# EAGLE design DVCA_v1_3 (EAGLE 7.3.0)
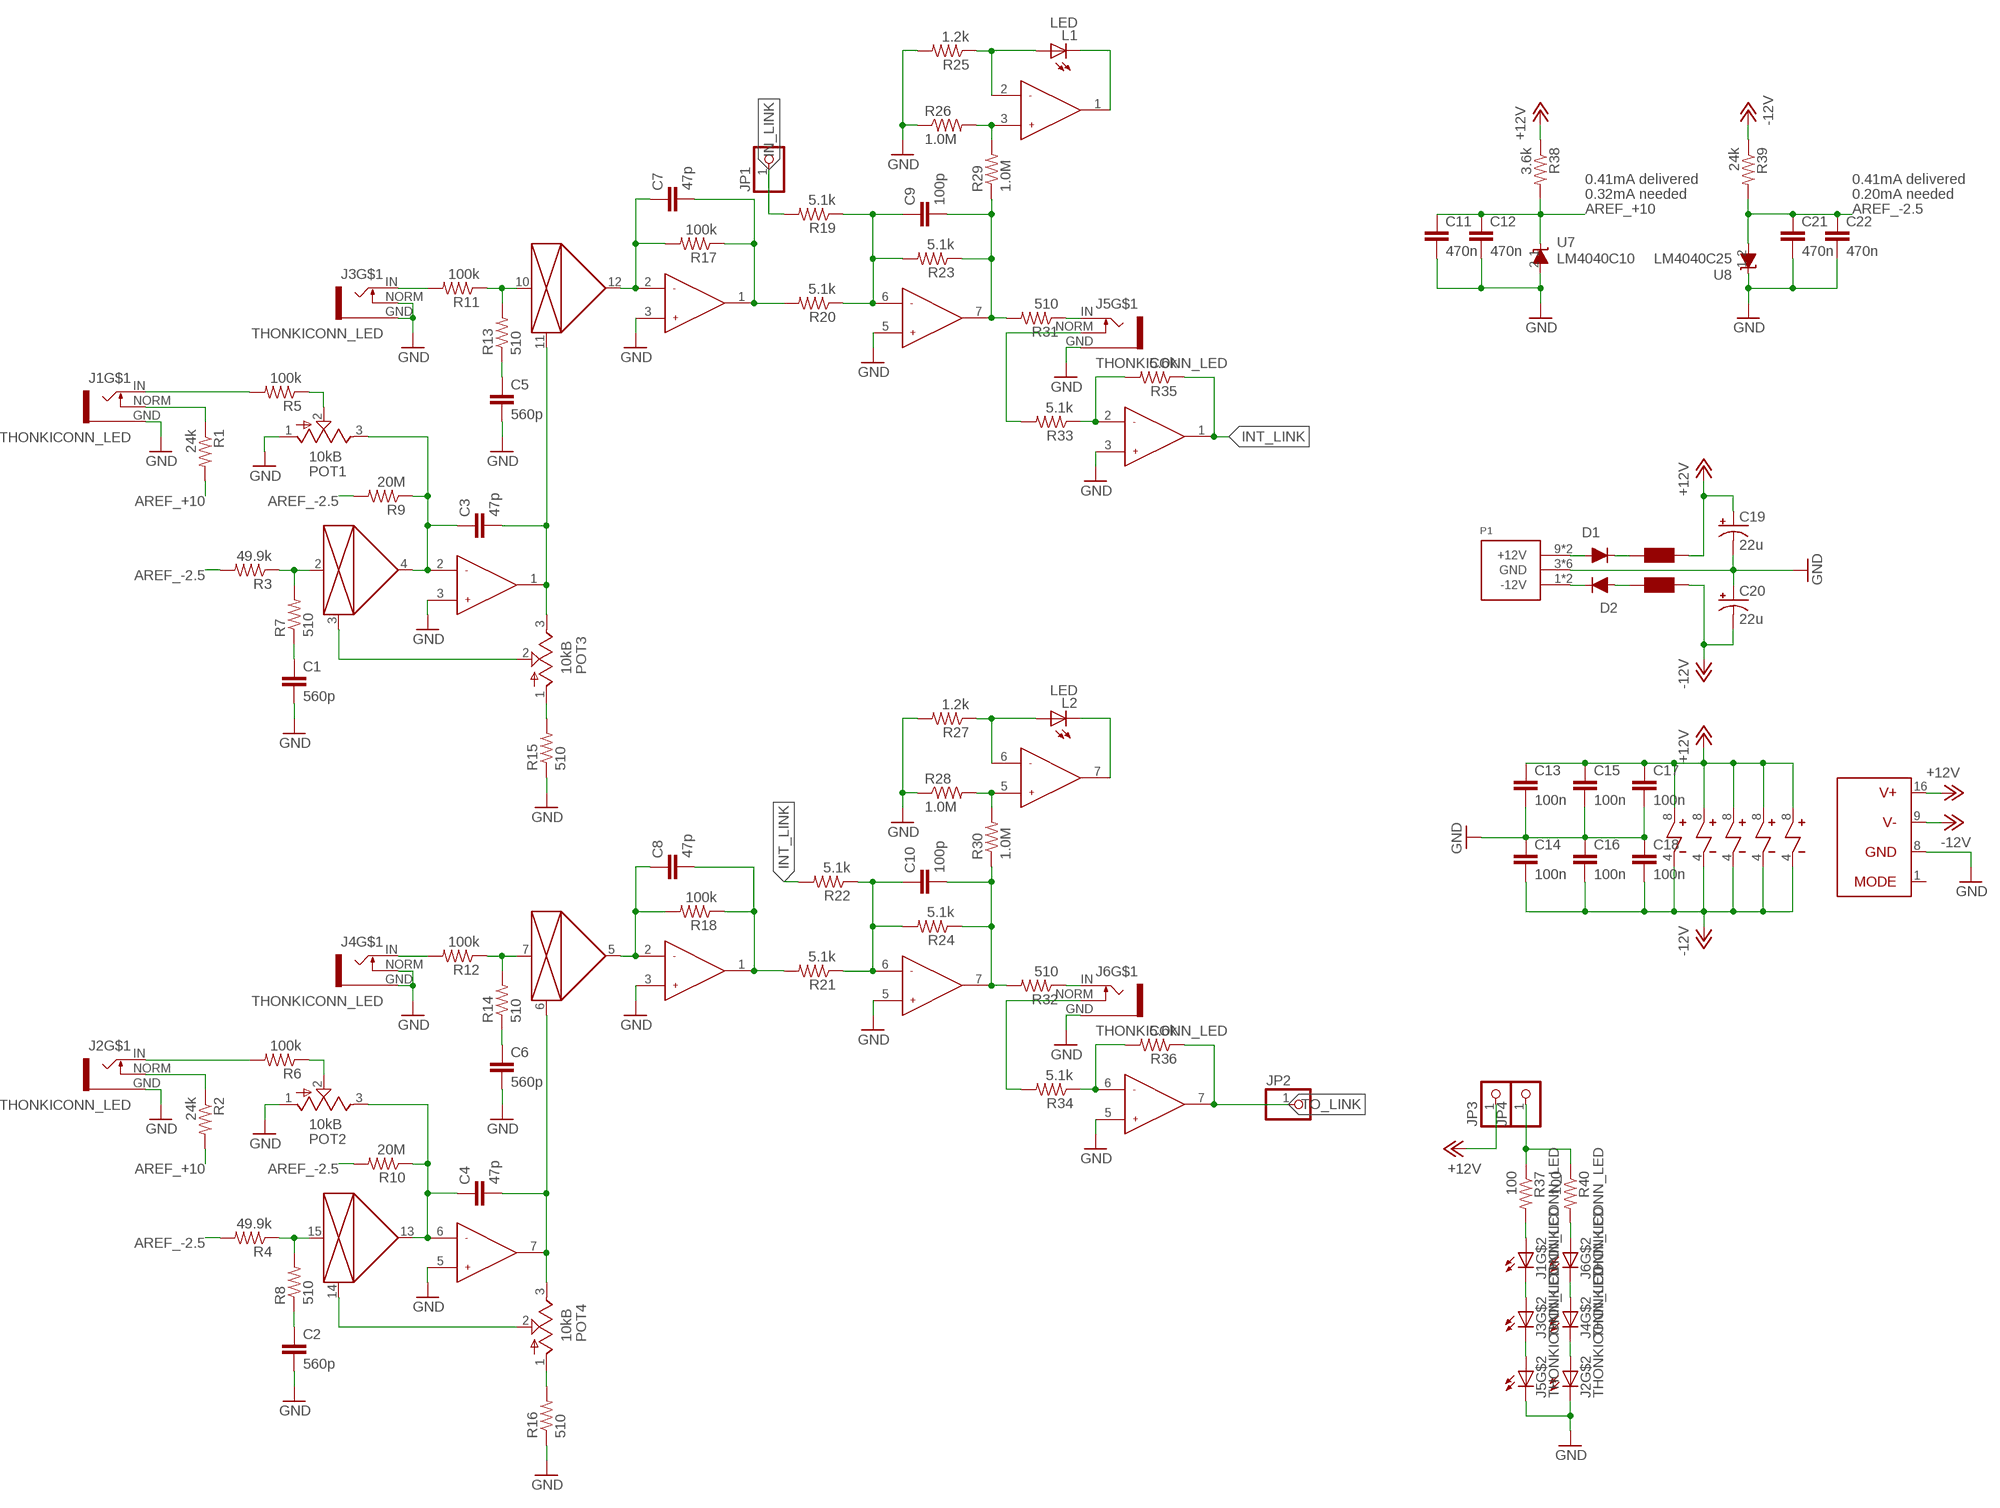
[diagram p0: schematic, sheet 1]

## Parts
C1  560p  CAPACITOR  [RESISTOR_0603]
C2  560p  CAPACITOR  [RESISTOR_0603]
C3  47p  CAPACITOR  [RESISTOR_0603]
C4  47p  CAPACITOR  [RESISTOR_0603]
C5  560p  CAPACITOR  [RESISTOR_0603]
C6  560p  CAPACITOR  [RESISTOR_0603]
C7  47p  CAPACITOR  [RESISTOR_0603]
C8  47p  CAPACITOR  [RESISTOR_0603]
C9  100p  CAPACITOR  [RESISTOR_0603]
C10  100p  CAPACITOR  [RESISTOR_0603]
C11  470n  CAPACITOR  [RESISTOR_0603]
C12  470n  CAPACITOR  [RESISTOR_0603]
C13  100n  CAPACITOR  [RESISTOR_0603]
C14  100n  CAPACITOR  [RESISTOR_0603]
C15  100n  CAPACITOR  [RESISTOR_0603]
C16  100n  CAPACITOR  [RESISTOR_0603]
C17  100n  CAPACITOR  [RESISTOR_0603]
C18  100n  CAPACITOR  [RESISTOR_0603]
C19  22u  CAP_POL  [PANASONIC_B]
C20  22u  CAP_POL  [PANASONIC_B]
C21  470n  CAPACITOR  [RESISTOR_0603]
C22  470n  CAPACITOR  [RESISTOR_0603]
D1  1N5819HW  DIODE  [SOD123]
D2  1N5819HW  DIODE  [SOD123]
F1  FERRITE-BEAD  [RESISTOR_0603]
F2  FERRITE-BEAD  [RESISTOR_0603]
J1  THONKICONN_LED  [LED_JACK]
J2  THONKICONN_LED  [LED_JACK]
J3  THONKICONN_LED  [LED_JACK]
J4  THONKICONN_LED  [LED_JACK]
J5  THONKICONN_LED  [LED_JACK]
J6  THONKICONN_LED  [LED_JACK]
JP1  PINHD-1X1  [1X01]
JP2  PINHD-1X1  [1X01]
JP3  PINHD-1X1  [1X01]
JP4  PINHD-1X1  [1X01]
L1  LED  [LED_3MM]
L2  LED  [LED_3MM]
P1  POWER_SIMPLE10  [POWER_10]
POT1  10kB  POT_VERTICAL  [ALPS_POT_VERTICAL]
POT2  10kB  POT_VERTICAL  [ALPS_POT_VERTICAL]
POT3  10kB  POT_VERTICALNOHOLE  [ALPS_POT_NOHOLE]
POT4  10kB  POT_VERTICALNOHOLE  [ALPS_POT_NOHOLE]
R1  24k  RESISTOR  [RESISTOR_0603]
R2  24k  RESISTOR  [RESISTOR_0603]
R3  49.9k  RESISTOR  [RESISTOR_0603]
R4  49.9k  RESISTOR  [RESISTOR_0603]
R5  100k  RESISTOR  [RESISTOR_0603]
R6  100k  RESISTOR  [RESISTOR_0603]
R7  510  RESISTOR  [RESISTOR_0603]
R8  510  RESISTOR  [RESISTOR_0603]
R9  20M  RESISTOR  [RESISTOR_0603]
R10  20M  RESISTOR  [RESISTOR_0603]
R11  100k  RESISTOR  [RESISTOR_0603]
R12  100k  RESISTOR  [RESISTOR_0603]
R13  510  RESISTOR  [RESISTOR_0603]
R14  510  RESISTOR  [RESISTOR_0603]
R15  510  RESISTOR  [RESISTOR_0603]
R16  510  RESISTOR  [RESISTOR_0603]
R17  100k  RESISTOR  [RESISTOR_0603]
R18  100k  RESISTOR  [RESISTOR_0603]
R19  5.1k  RESISTOR  [RESISTOR_0603]
R20  5.1k  RESISTOR  [RESISTOR_0603]
R21  5.1k  RESISTOR  [RESISTOR_0603]
R22  5.1k  RESISTOR  [RESISTOR_0603]
R23  5.1k  RESISTOR  [RESISTOR_0603]
R24  5.1k  RESISTOR  [RESISTOR_0603]
R25  1.2k  RESISTOR  [RESISTOR_0603]
R26  1.0M  RESISTOR  [RESISTOR_0603]
R27  1.2k  RESISTOR  [RESISTOR_0603]
R28  1.0M  RESISTOR  [RESISTOR_0603]
R29  1.0M  RESISTOR  [RESISTOR_0603]
R30  1.0M  RESISTOR  [RESISTOR_0603]
R31  510  RESISTOR  [RESISTOR_0603]
R32  510  RESISTOR  [RESISTOR_0603]
R33  5.1k  RESISTOR  [RESISTOR_0603]
R34  5.1k  RESISTOR  [RESISTOR_0603]
R35  5.6k  RESISTOR  [RESISTOR_0603]
R36  5.6k  RESISTOR  [RESISTOR_0603]
R37  100  RESISTOR  [RESISTOR_0603]
R38  3.6k  RESISTOR  [RESISTOR_0603]
R39  24k  RESISTOR  [RESISTOR_0603]
R40  100  RESISTOR  [RESISTOR_0603]
U1  V2164M  [SOIC16]
U2  OPAMP_DUAL  [SOIC8]
U3  OPAMP_DUAL  [SOIC8]
U4  OPAMP_DUAL  [SOIC8]
U5  OPAMP_DUAL  [SOIC8]
U6  OPAMP_DUAL  [SOIC8]
U7  LM4040C10  LM4040SOT23  [SOT23]
U8  LM4040C25  LM4040SOT23  [SOT23]

## Nets
+12V: C13.1 C15.1 C17.1 C19.+ F1.1 JP3.1 R38.1 U1.16 U2.8 U3.8 U4.8 U5.8 U6.8
-12V: C14.2 C16.2 C18.2 C20.- F2.1 R39.1 U1.9 U2.4 U3.4 U4.4 U5.4 U6.4
AREF_+10: C11.1 C12.1 R1.2 R2.2 R38.2 U7.1(C)
AREF_-2.5: C21.1 C22.1 R3.2 R4.2 R9.2 R10.2 R39.2 U8.2(A)
CV_IN_1: J1.IN R5.2
FOO: R3.1 R7.2 U1.2
FOO1: R4.1 R8.2 U1.15
GND: C1.2 C2.2 C5.2 C6.2 C11.2 C12.2 C13.2 C14.1 C15.2 C16.1 C17.2 C18.1 C19.- C20.+ C21.2 C22.2 J1.GND J2.C J2.GND J3.GND J3.NORM J4.GND J4.NORM J5.C J5.GND J6.GND P1.3(GND) P1.4(GND) P1.5(GND) P1.6(GND) P1.7(GND) P1.8(GND) POT1.1(A) POT2.1(A) R15.1 R16.1 R25.2 R26.1 R27.2 R28.1 U1.8 U2.3 U2.5 U3.3 U3.5 U4.3 U4.5 U6.3 U6.5 U7.2(A) U8.1(C)
IN_LINK: JP1.1 R19.2
INT_LINK: R22.2 R35.1 U6.1
N$1: R26.2 R29.2 U5.3
N$2: D1.+ P1.9(+12V) P1.10(+12V)
N$3: J4.IN R12.2
N$4: R28.2 R30.2 U5.5
N$5: D2.- P1.1(-12V) P1.2(-12V)
N$6: J6.IN R32.1
N$7: J5.IN R31.1
N$8: D1.- F1.2
N$9: POT3.2(W) U1.3
N$10: C9.1 R19.1 R20.1 R23.2 U3.6
N$11: J2.A J4.C
N$12: JP4.1 R37.1 R40.1
N$13: J4.A J6.C
N$14: POT1.2(W) R5.1
N$15: POT3.1(A) R15.2
N$17: C6.1 R14.1
N$18: L1.K(C) U5.1
N$19: L1.A R25.1 U5.2
N$20: C1.1 R7.1
N$21: J1.NORM R1.1
N$22: R33.1 R35.2 U6.2
N$23: D2.+ F2.2
N$24: R12.1 R14.2 U1.7
N$25: J5.NORM R33.2
N$26: POT4.2(W) U1.14
N$27: C10.1 R21.1 R22.1 R24.2 U4.6
N$28: J6.A R40.2
N$29: J3.C J5.A
N$30: J1.C J3.A
N$31: J1.A R37.2
N$32: POT4.1(A) R16.2
N$33: C4.2 POT4.3(B) U1.6 U2.7
N$34: C4.1 POT2.3(B) R10.1 U1.13 U2.6
N$35: L2.K(C) U5.7
N$36: L2.A R27.1 U5.6
N$37: R34.1 R36.2 U6.6
N$38: J6.NORM R34.2
N$39: C8.2 R18.1 R21.2 U4.1
N$40: POT2.2(W) R6.1
N$41: C2.1 R8.1
N$43: C3.1 POT1.3(B) R9.1 U1.4 U2.2
N$44: J2.IN R6.2
N$47: C5.1 R13.1
N$53: C8.1 R18.2 U1.5 U4.2
N$64: J2.NORM R2.1
N$66: J3.IN R11.2
N$75: R11.1 R13.2 U1.10
N$87: C3.2 POT3.3(B) U1.11 U2.1
N$96: C7.1 R17.2 U1.12 U3.2
N$100: C7.2 R17.1 R20.2 U3.1
OUT1: C9.2 R23.1 R29.1 R31.2 U3.7
OUT2: C10.2 R24.1 R30.1 R32.2 U4.7
TO_LINK: JP2.1 R36.1 U6.7
Unconnected: U1.1

## Notes on the sheet
- 0.41mA delivered | 0.41mA delivered
- 0.32mA needed | 0.20mA needed

## Library data of the parts
C1-C18 C21 C22 = parts_aman:CAPACITOR
C19 C20 = parts_aman:CAP_POL
D1 D2 = parts_aman:DIODE
F1 F2 = parts_aman:FERRITE-BEAD
J1-J6 = parts_aman:THONKICONN_LED
JP1-JP4 = parts_aman:PINHD-1X1: PIN HEADER
L1 L2 = parts_aman:LED
P1 = parts_aman:POWER_SIMPLE
POT1-POT4 = parts_aman:POT_VERTICAL
R1-R40 = parts_aman:RESISTOR
U1 = parts_aman:V2164M
U2-U6 = parts_aman:OPAMP_DUAL
U7 U8 = parts_aman:LM4040

## Board
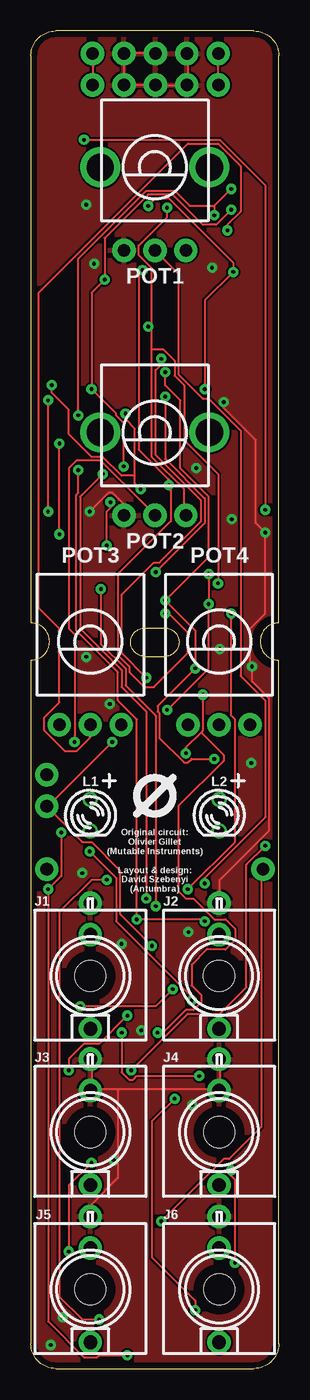
[diagram p1: board, top side]
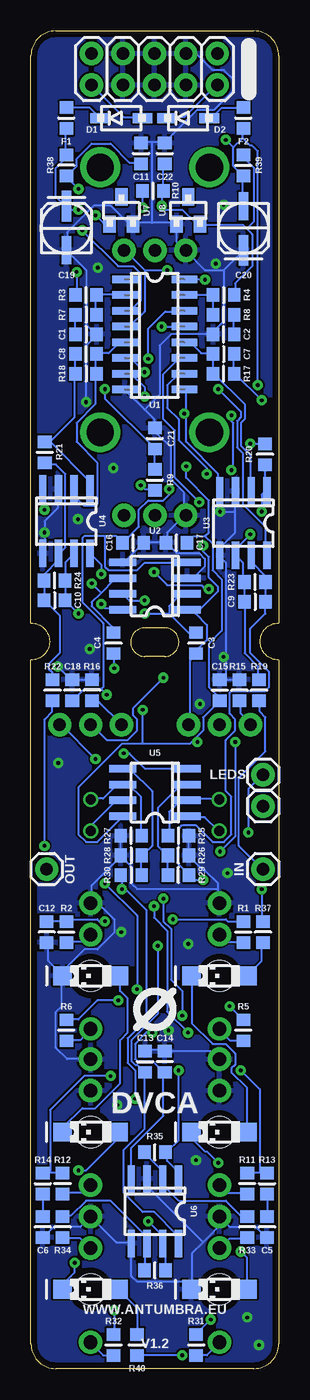
[diagram p2: board, bottom side, seen from below]

Size 20 x 108 mm. Coordinates in mm from the lower left corner, seen from the top.
Outline: 2,0 18,0 arc90 20,2 20,57.2 arc-180 20,60.2 20,106 arc90 18,108 2,108 arc90 0,106 0,60.2 arc-180 0,57.2 0,2 arc90 2,0
Outline: 9.2,57.5 arc-180 9.2,59.8 10.8,59.8 arc-180 10.8,57.5 9.2,57.5
Copper layers (1*16): Top 0.035mm / dielectric 1.5mm / Bottom 0.035mm
Design rules "PCBCart-Standard *": minimum track width 6mil, minimum drill 12mil, track to track 6mil, track to pad 6mil, pad to pad 6mil, via to via 6mil, smd to smd 6mil, copper to edge 20mil, drill to drill 8mil, minimum pad ring 8mil, minimum via ring 10mil, stop-mask expansion 3mil, vias tented up to drill 25mil, thermal gap 8mil
tRestrict: area -2.2,56.5 to 2.2,60.9; area 7.4,56.8 to 11,60.5; area 9,56.8 to 12.6,60.5; area 17.8,56.5 to 22.2,60.9; area 9.2,56.8 to 10.8,60.4
bRestrict: area 7.4,56.8 to 11,60.5; area 9,56.8 to 12.6,60.5; area 17.8,56.5 to 22.2,60.9; area -2.2,56.5 to 2.2,60.9; area 9.2,56.8 to 10.8,60.4

### Footprints (pad centres in the part's own frame; a part is rotated, then mirrored left to right if it is on the bottom)
RESISTOR_0603 = smd 1 x 1.1: 1 -0.85,0; 2 0.85,0
PANASONIC_B = smd 2.464 x 0.762: + 1.778,0 | smd 2.286 x 0.762: - -1.778,0
SOD123 = smd 1.6 x 0.8: + 1.7,0; - -1.7,0
LED_JACK = smd 1.5 x 1.5 bottom: A 2.266,0; C -2.266,0 | drill 1.1 pad 1.88: GND 0,-5.88; IN 0,4.28; NORM 0,-3.34 | hole 2.5: 0,0
1X01 = drill 1.016 pad 1.88: 1 0,0
LED_3MM = drill 0.813: A -1.27,0; K 1.27,0
POWER_10 = drill 1.016 pad 1.88: 1 -5.08,-1.27; 2 -5.08,1.27; 3 -2.54,-1.27; 4 -2.54,1.27; 5 0,-1.27; 6 0,1.27; 7 2.54,-1.27; 8 2.54,1.27; 9 5.08,-1.27; 10 5.08,1.27
ALPS_POT_VERTICAL = drill 1 pad 1.88: 1 -2.5,-6.7; 2 0,-6.7; 3 2.5,-6.7 | drill 2.2 pad 3.175: P$4 4.4,0; P$5 -4.4,0
ALPS_POT_NOHOLE = drill 1 pad 1.88: 1 -2.5,-6.7; 2 0,-6.7; 3 2.5,-6.7
SOIC16 = smd 2.057 x 0.61: 1 -2.419,4.445; 2 -2.419,3.175; 3 -2.419,1.905; 4 -2.419,0.635; 5 -2.419,-0.635; 6 -2.419,-1.905; 7 -2.419,-3.175; 8 -2.419,-4.445; 9 2.381,-4.445; 10 2.381,-3.175; 11 2.381,-1.905; 12 2.381,-0.635; 13 2.381,0.635; 14 2.381,1.905; 15 2.381,3.175; 16 2.381,4.445
SOIC8 = smd 0.6 x 2.2: 1 -1.905,-2.6; 2 -0.635,-2.6; 3 0.635,-2.6; 4 1.905,-2.6; 5 1.905,2.6; 6 0.635,2.6; 7 -0.635,2.6; 8 -1.905,2.6
SOT23 = smd 1 x 1.4: 1 -0.95,-1.1; 2 0.95,-1.1; 3 0,1.1

### Placement (x,y rotation side)
C1  15.56,83.5 0 bottom
C2  4.44,83.5 180 bottom
C3  6.67,58.58 270 bottom
C4  13.33,58.58 270 bottom
C5  0.95,11.43 270 bottom
C6  19.05,11.43 270 bottom
C7  4.44,81.92 0 bottom
C8  15.56,81.92 180 bottom
C9  1.91,61.91 0 bottom
C10  18.1,62.04 0 bottom
C11  11.11,98.11 90 bottom
C12  18.73,35.24 270 bottom
C13  10.79,24.77 90 bottom
C14  9.21,24.77 270 bottom
C15  4.76,54.77 90 bottom
C16  11.75,66.67 180 bottom
C17  8.25,66.67 180 bottom
C18  16.67,54.77 270 bottom
C19  17.15,92.08 90 bottom
C20  2.86,92.08 270 bottom
C21  10,75.09 90 bottom
C22  9.21,98.11 90 bottom
D1  12.7,100.97 0 bottom
D2  7.3,100.97 0 bottom
F1  17.15,100.97 90 bottom
F2  2.86,100.97 90 bottom
J1  4.79,31.7 180 top
J2  15.18,31.7 180 top
J3  4.79,19.1 180 top
J4  15.19,19.1 180 top
J5  4.79,6.4 180 top
J6  15.19,6.4 180 top
JP1  1.27,40.32 0 bottom
JP2  18.73,40.32 0 bottom
JP3  1.27,45.4 0 bottom
JP4  1.27,47.94 0 bottom
L1  4.79,44.67 270 top
L2  15.19,44.67 270 top
P1  10.04,104.91 180 bottom
POT1  10,96.99 0 top
POT2  10,75.59 0 top
POT3  4.79,58.69 0 top
POT4  15.18,58.69 0 top
R1  2.86,35.24 90 bottom
R2  17.15,35.24 90 bottom
R3  15.56,86.68 180 bottom
R4  4.44,86.68 0 bottom
R5  2.86,27.3 270 bottom
R6  17.15,27.3 270 bottom
R7  15.56,85.09 0 bottom
R8  4.44,85.09 180 bottom
R9  10,71.76 90 bottom
R10  10.16,95.09 0 bottom
R11  2.54,14.92 270 bottom
R12  17.46,14.92 270 bottom
R13  0.95,14.92 90 bottom
R14  19.05,14.92 90 bottom
R15  3.17,54.77 270 bottom
R16  15.08,54.77 270 bottom
R17  4.44,80.33 180 bottom
R18  15.56,80.33 0 bottom
R19  1.59,54.77 270 bottom
R20  1.11,73.82 270 bottom
R21  18.89,73.98 90 bottom
R22  18.26,54.77 270 bottom
R23  1.91,63.5 180 bottom
R24  18.1,63.62 180 bottom
R25  8.1,43.02 0 bottom
R26  8.1,41.43 180 bottom
R27  11.91,43.02 180 bottom
R28  11.91,41.43 0 bottom
R29  8.1,39.85 180 bottom
R30  11.91,39.85 0 bottom
R31  6.67,1.91 90 bottom
R32  13.33,1.91 90 bottom
R33  2.54,11.43 270 bottom
R34  17.46,11.43 270 bottom
R35  10,17.46 180 bottom
R36  10,7.94 180 bottom
R37  1.27,35.24 270 bottom
R38  17.15,97.16 270 bottom
R39  2.86,97.16 90 bottom
R40  11.44,1.9 90 bottom
U1  10,83.5 0 bottom
U2  10,63.18 90 bottom
U3  2.86,68.26 180 bottom
U4  17.15,68.42 180 bottom
U5  10,46.51 90 bottom
U6  10,12.7 180 bottom
U7  12.7,93.5 0 bottom
U8  7.3,93.5 0 bottom
U$1  [LOGO_3.5]  10,29 0 bottom
U$2  [LOGO_3.5]  10,46.25 0 top

### Tracks (layer width: path | path; a pad name or v marks a point on that pad's centre or on a via)
+12V  (via drill 0.3)
  Top 0.152: v16.16,93.57 14.95,92.35 13.88,92.35 11.44,94.79 9.46,94.79 5.95,91.28 v5.95,87.93 4.89,86.86 v4.89,79.09 6.87,77.11 6.87,76.96 7.48,76.35 v7.48,72.84 | v14.34,64.16 v14.34,61.72 14.34,56.54 v10.98,53.18 | v6.56,50.59 1.38,45.41 JP3.1 1.38,45.26 4.12,42.52 4.89,42.52 7.17,40.23 7.17,36.72 v9.76,34.13
  Bottom 0.152: F1.1 17.23,99.97 17.23,98.14 R38.1 17.23,97.99 17.23,97.68 17.99,96.92 17.99,94.64 17.23,93.87 C19.+ 17.08,93.72 16.93,93.57 v16.16,93.57 | v5.95,87.93 7.48,87.93 U1.16 | v4.89,79.09 3.06,77.26 3.06,76.81 3.36,76.5 3.36,74.37 2.91,73.91 2.91,69.8 1.08,67.97 1.08,65.68 U3.8 | U6.8 8.24,10.21 8.24,10.82 10.07,12.65 10.98,12.65 12.51,14.17 12.51,17.67 10.83,19.35 10.83,23.77 C13.1 10.83,23.92 11.44,24.53 11.59,24.53 11.9,24.84 11.9,26.51 9.76,28.65 v9.76,34.13 | v14.34,61.72 14.03,61.41 12.66,61.41 U2.8 | v14.34,64.16 14.34,64.92 15.1,65.68 U4.8 | 5.95,67.2 5.34,66.6 5.34,64.46 4.58,63.7 4.58,59.58 5.65,58.52 5.65,55.01 4.89,54.25 4.89,53.95 C15.1 4.89,53.79 6.11,52.57 6.11,51.51 6.56,51.05 | 5.95,67.2 6.87,67.2 7.33,66.75 C17.1 | 10.98,50.44 7.17,50.44 6.56,51.05 | 10.98,50.44 12.66,50.44 16.16,46.94 16.16,43.13 15.55,42.52 14.64,42.52 12.66,44.5 U5.8 | 6.56,51.05 v6.56,50.59 | 10.98,50.44 v10.98,53.18 | v7.48,72.84 7.48,71.93 5.65,70.1 5.65,67.51 5.95,67.2
-12V  (via drill 0.3)
  Top 0.152: v18.91,69.34 18.91,95.55 15.25,99.21 v4.28,99.21 | v12.51,49.68 12.51,50.14 13.73,51.36 | 13.73,51.36 13.88,51.51 v13.88,54.4 | v10.22,27.12 10.68,27.12 12.51,28.95 13.12,28.95 13.73,29.56 13.73,30.17 12.96,30.93 12.96,32.61 14.18,33.83 15.71,33.83 16.47,34.59 16.47,35.51 15.71,36.27 14.79,36.27 13.12,37.94 12.51,37.94 11.9,38.55 11.9,45.41 15.55,49.07 15.55,49.53 13.73,51.36 | v7.63,77.11 7.63,76.65 8.39,75.89 8.39,72.08 | 8.39,72.08 8.39,71.47 v8.85,71.01 | v1.69,79.4 1.69,78.79 3.06,77.42 3.06,75.43 4.89,73.61 5.8,73.61 7.33,72.08 8.39,72.08
  Bottom 0.152: C20.- 2.91,93.87 2.91,96.16 R39.1 2.91,96.31 3.67,97.08 3.67,98.6 | 2.91,99.36 2.91,99.97 F2.1 | 3.67,98.6 2.91,99.36 | v18.91,69.34 18.91,71.01 U4.4 | 3.67,98.6 v4.28,99.21 | 7.48,77.11 7.48,74.82 4.89,72.23 4.89,71.01 U3.4 | 7.48,77.11 7.48,78.94 U1.9 | U6.4 11.9,15.39 11.9,17.83 9.31,20.42 9.31,23.77 C14.2 9.31,23.92 10.22,24.84 11.44,24.84 11.59,24.99 11.59,26.21 10.68,27.12 v10.22,27.12 | 14.34,54.86 15.71,54.86 16.62,53.95 C18.2 | 14.34,54.86 14.18,55.01 14.18,60.19 15.86,61.87 15.86,67.05 15.71,67.2 14.03,67.2 | 14.03,67.2 13.12,67.2 12.66,66.75 C16.2 12.51,66.75 11.29,67.97 11.29,69.34 10.53,70.1 9.31,70.1 8.85,70.56 v8.85,71.01 | v12.51,49.68 12.05,49.68 10.83,48.46 7.48,48.46 U5.4 | 14.34,54.86 v13.88,54.4 | 14.03,67.2 14.03,64.77 13.73,64.46 11.44,64.46 10.83,65.07 7.48,65.07 U2.4 | v7.63,77.11 7.48,77.11 | 2.91,99.36 2.3,98.75 2.14,98.75 1.69,98.29 v1.69,79.4
AREF_+10  (via drill 0.3)
  Top 0.152: 14.79,93.87 v14.79,93.11 | v16.16,95.25 14.79,93.87 | v14.03,36.12 13.88,36.27 v8.54,36.27 8.54,52.42 7.02,53.95 7.02,56.23 3.67,59.58 3.67,70.56 3.82,70.71 v3.82,72.54 | 14.79,93.87 12.81,93.87 11.59,95.09 9.31,95.09 3.82,89.61 v3.82,76.96
  Bottom 0.152: C11.1 11.13,97.38 12.05,97.38 13.57,98.9 15.1,98.9 16.32,97.68 16.32,97.08 17.08,96.31 R38.2 17.08,96.16 v16.16,95.25 | v14.79,93.11 14.18,92.5 13.73,92.5 U7.1 | v8.54,36.27 4.28,36.27 4.12,36.12 2.91,36.12 R1.2 | v14.03,36.12 14.49,36.12 14.64,36.27 16.93,36.27 17.08,36.12 R2.2 17.23,36.12 18.6,36.12 C12.1 | v3.82,76.96 3.82,76.5 3.67,76.35 3.67,72.69 v3.82,72.54
AREF_-2.5  (via drill 0.3)
  Top 0.152: v9.46,93.87 10.07,94.48 11.13,94.48 16.32,89.3 v16.32,88.54 14.03,86.25 v14.03,79.09
  Bottom 0.152: 2.6,92.05 2.91,92.35 6.26,92.35 U8.2 6.41,92.5 6.72,92.5 7.78,93.57 9.15,93.57 v9.46,93.87 9.46,94.94 R10.2 9.31,97.23 C22.1 | 2.6,92.05 2.14,91.59 2.14,89 3.51,87.63 3.51,86.71 R4.2 | 2.6,92.05 1.99,92.66 1.99,96.92 2.75,97.68 2.75,97.99 R39.2 | R9.2 10.07,72.69 10.07,74.22 C21.1 10.07,74.37 14.03,78.33 v14.03,79.09 | v16.32,88.54 16.32,86.71 R3.2
CV_IN_1
  Bottom 0.152: R5.2 2.91,26.51 3.97,26.51 4.73,27.28 J1.IN
FOO
  Bottom 0.152: R7.2 14.79,85.19 14.79,86.56 R3.1 14.64,86.71 12.51,86.71 U1.2
FOO1
  Bottom 0.152: R8.2 5.34,85.19 5.34,86.56 R4.1 5.34,86.71 7.48,86.71 U1.15
GND  (via drill 0.3)
  Top 0.152: v4.73,69.19 6.26,70.71 6.56,70.71 7.48,69.8 7.48,69.03 POT2.1 | P1.7 12.66,106.07 12.66,103.78 P1.8 12.51,103.63 10.07,103.63 P1.6 9.92,103.63 7.63,103.63 P1.4 7.48,103.78 7.48,106.07 P1.3 7.63,106.22 9.92,106.22 P1.5 | 4.89,22.55 4.89,24.84 J3.GND | J4.GND 15.25,24.84 15.25,22.55 J4.NORM 15.1,22.55 7.02,22.55 | 7.02,22.55 4.89,22.55 | 4.89,22.55 J3.NORM | 7.02,22.55 7.02,15.39 4.89,13.26 4.89,12.34 J5.GND | J2.GND 15.25,37.64 15.25,39.47 19.21,43.43 19.21,54.1 17.84,55.47 v17.84,56.69 17.69,56.84 17.69,59.74 18.91,60.96 v18.91,67.51 18.15,68.27 18.15,74.98 15.55,77.57 v15.55,78.03
  Bottom 0.152: 4.28,55.62 4.73,55.62 C15.2 4.28,55.62 | 4.28,55.62 3.21,55.62 R15.1 | 4.28,55.62 4.28,65.07 4.73,65.53 U3.5 4.73,65.68 4.73,66.29 3.51,67.51 3.51,69.19 | 3.51,69.19 3.51,70.86 U3.3 | C17.2 9.15,66.75 10.83,66.75 C16.1 10.98,66.6 12.51,65.07 U2.5 | U2.3 7.33,63.85 6.87,63.85 5.95,64.77 5.95,65.38 6.41,65.83 8.24,65.83 9,66.6 C17.2 | 10.83,77.42 12.35,78.94 U1.8 | 10.83,77.42 10.07,76.65 10.07,76.04 C21.2 9.92,75.89 9.92,75.59 8.7,74.37 8.7,71.78 7.63,70.71 7.63,69.03 POT2.1 7.63,68.88 9,67.51 9,66.75 C17.2 | v4.73,69.19 3.51,69.19 | 4.43,88.69 4.43,84.58 5.19,83.82 5.19,83.51 C2.2 5.34,83.51 8.7,83.51 9.61,82.6 9.61,78.63 10.83,77.42 | 4.43,88.69 2.91,90.22 C20.+ | 10.22,99.06 10.98,99.06 C11.2 | 10.22,99.06 9.31,99.06 C22.2 9.15,99.06 6.56,101.65 5.19,101.65 3.67,103.17 3.67,104.09 4.43,104.85 5.34,104.85 6.56,106.07 7.48,106.07 P1.3 | 10.22,92.5 8.39,92.5 U8.1 8.24,92.35 8.24,90.98 7.63,90.37 POT1.1 7.48,90.22 5.95,88.69 4.43,88.69 | 10.22,92.5 11.74,92.5 U7.2 11.9,92.5 12.2,92.5 13.57,93.87 14.95,93.87 17.08,91.74 17.08,90.37 C19.- 17.08,90.22 15.55,88.69 15.55,84.27 14.79,83.51 C1.2 14.79,83.36 15.55,82.6 v15.55,78.03 | 10.22,92.5 10.22,99.06 | C6.2 18.91,10.66 18.15,11.43 16.01,11.43 15.25,12.19 J6.GND 15.1,12.19 13.12,10.21 12.05,10.21 U6.5 11.9,10.05 11.9,7.46 11.44,7.01 7.02,7.01 | 4.43,11.88 4.73,12.19 J5.GND 4.43,11.88 | 4.43,11.88 3.97,11.43 1.84,11.43 1.08,10.66 C5.2 | 7.02,7.01 7.02,9.29 6.11,10.21 | 7.02,7.01 7.02,6.4 J5.C 7.02,7.01 | 4.43,11.88 6.11,10.21 | 6.11,10.21 10.53,14.63 10.53,15.24 U6.3 | C13.2 10.68,25.75 9.31,25.75 C14.1 9.15,25.6 5.5,25.6 4.89,24.99 J3.GND
  Bottom 0.152: C12.2 18.6,34.29 18.6,32.91 17.54,31.85 J2.C | J2.C 17.54,31.7 17.54,29.26 17.99,28.8 17.99,25.9 17.08,24.99 15.25,24.99 J4.GND | R25.2 7.33,42.97 7.33,41.45 R26.1 7.17,41.3 6.11,40.23 5.95,40.23 4.89,39.16 4.89,38.71 | 4.89,38.71 4.89,37.64 J1.GND | U4.5 18.91,65.83 v18.91,67.51 18.91,68.42 17.84,69.49 17.84,71.01 U4.3 | R16.1 15.1,55.62 16.62,55.62 C18.1 16.77,55.62 v17.84,56.69 | R28.1 12.81,41.45 12.81,42.97 R27.2 | R28.1 12.81,41.3 15.1,39.01 15.1,37.64 J2.GND 15.1,37.49 14.49,37.49 13.27,36.27 13.27,35.2 14.64,33.83 15.71,33.83 17.38,32.15 17.38,31.85 J2.C | 4.89,38.71 11.44,38.71 11.9,39.16 11.9,40.53 12.66,41.3 R28.1
  other vias: 1.6,1.9 2.55,4.12 6.68,16.82 13.03,21.27 7.31,34.29 4.14,40 12.71,35.24 8.9,27.3 17.79,48.89 15.25,58.1 4.46,57.46 5.09,89.21 14.62,88.9 16.2,68.58 13.35,72.7 4.46,93.98 6.36,53.65
  pour Top: 0.01,0 20.01,0 20.01,107.95 0.01,107.95
  pour Bottom: 0.01,0 20.01,0 20.01,107.95 0.01,107.95
IN_LINK
  Bottom 0.152: R19.2 1.53,53.79 1.53,53.03 1.08,52.57 1.08,49.83 3.21,47.7 3.21,42.21 1.38,40.38 JP1.1
INT_LINK  (via drill 0.3)
  Top 0.152: v18.91,42.21 17.38,40.69 17.38,30.78 15.25,28.65 12.66,28.65 v8.09,24.08
  Bottom 0.152: U6.1 8.24,15.39 8.24,16 9,16.76 9,17.37 R35.1 9,17.52 8.09,18.44 v8.09,24.08 | v18.91,42.21 18.91,52.42 18.3,53.03 18.3,53.79 R22.2
N$1
  Bottom 0.152: R29.2 9,39.93 9,41.3 R26.2 9,41.45 9.76,42.21 9.76,45.26 7.93,47.09 7.48,47.09 U5.3
N$2
  Top 0.152: P1.9 15.1,106.07 15.1,103.78 P1.10
  Bottom 0.152: D1.+ 11.13,101.04 12.51,101.04 15.1,103.63 P1.10
N$3
  Bottom 0.152: R12.2 17.38,14.17 15.86,14.17 15.25,14.78 J4.IN
N$4
  Bottom 0.152: R30.2 11.13,39.93 11.13,41.3 R28.2 10.98,41.45 10.22,42.21 10.22,46.63 11.9,48.31 12.51,48.31 U5.5
N$5
  Top 0.152: P1.1 5.04,106.07 5.04,103.78 P1.2
  Bottom 0.152: D2.- 9,101.04 7.63,101.04 5.04,103.63 P1.2
N$6
  Bottom 0.152: R32.1 13.42,1.06 14.18,1.06 15.1,1.98 J6.IN
N$7
  Bottom 0.152: R31.1 6.56,1.06 5.8,1.06 4.89,1.98 J5.IN
N$8
  Bottom 0.152: F1.2 17.08,101.8 15.25,101.8 14.49,101.04 D1.-
N$9  (via drill 0.3)
  Top 0.152: v15.86,91.89 15.86,92.35 16.93,93.42 16.93,97.08 15.1,98.9 12.66,98.9 0.62,86.86 0.62,61.41 2.3,59.74 2.3,53.79 1.08,52.57 1.08,51.51 2.75,49.83 3.67,49.83 4.73,50.9 4.73,51.96 POT3.2
  Bottom 0.152: v15.86,91.89 12.96,89 11.74,89 11.13,88.39 11.13,86.25 11.9,85.49 12.35,85.49 U1.3
N$10  (via drill 0.3)
  Top 0.152: v2.3,67.36 v2.3,74.67
  Bottom 0.152: R19.1 1.69,55.62 1.69,56.69 2.75,57.76 2.75,61.87 C9.1 2.75,62.02 2.75,63.39 R23.2 2.91,63.55 2.91,65.07 3.36,65.53 U3.6 3.36,65.68 3.36,66.29 v2.3,67.36 | v2.3,74.67 1.23,74.67 R20.1
N$11
  Bottom 0.152: J2.A 12.81,31.7 12.81,30.48 12.2,29.87 12.2,27.12 12.81,26.51 12.81,23.01 14.79,21.03 15.86,21.03 17.38,19.5 17.38,19.2 J4.C
N$12  (via drill 0.3)
  Top 0.152: v2.45,43.28 2.45,39.77 v1.38,38.71 1.38,3.81 4.28,0.91 5.34,0.91 5.5,1.06 v7.78,1.06
  Bottom 0.152: v1.38,38.71 1.38,36.12 R37.1 | v2.45,43.28 2.45,46.78 1.38,47.85 JP4.1 | v7.78,1.06 R40.1
N$13  (via drill 0.3)
  Top 0.152: v16.16,16 16.16,15.54 16.47,15.24 v16.47,8.53
  Bottom 0.152: v16.16,16 15.55,16 12.96,18.59 12.96,19.05 J4.A | v16.47,8.53 16.47,7.77 17.38,6.85 17.38,6.4 J6.C
N$14  (via drill 0.3)
  Top 0.152: v3.97,29.26 10.07,29.26 v11.44,30.63 | v14.03,39.16 14.03,39.62 18.91,44.5 18.91,53.95 16.93,55.93 16.93,75.74 14.34,78.33 13.88,78.33 11.9,80.31 11.9,88.39 10.07,90.22 POT1.2
  Bottom 0.152: v3.97,29.26 2.91,28.19 R5.1 | v11.44,30.63 11.44,36.57 v14.03,39.16
N$15
  Bottom 0.152: R15.2 3.06,53.79 3.06,52.88 2.3,52.12 POT3.1
N$17
  Bottom 0.152: C6.1 19.06,12.34 19.06,14.02 R14.1
N$18
  Bottom 0.152: U5.1 7.33,44.5 5.95,44.5 4.89,43.43 L1.K
N$19
  Bottom 0.152: R25.1 8.85,43.13 8.85,44.95 7.93,45.87 7.48,45.87 U5.2 7.33,46.02 4.89,46.02 L1.A
N$20
  Bottom 0.152: C1.1 16.47,83.51 16.47,85.04 R7.1
N$21
  Bottom 0.152: R1.1 2.91,34.44 4.28,34.44 4.73,34.9 J1.NORM
N$22
  Bottom 0.152: R33.1 2.6,12.34 3.06,12.34 4.28,13.56 8.09,13.56 9.31,14.78 9.31,15.24 U6.2 9.46,15.39 9.46,16 10.83,17.37 R35.2
N$23
  Bottom 0.152: F2.2 2.91,101.8 4.58,101.8 5.5,100.89 D2.+
N$24  (via drill 0.3)
  Top 0.152: v13.57,23.62 8.54,23.62 8.24,23.31 7.93,23.31 7.33,23.92 v7.33,27.12 | v10.07,37.33 10.07,52.73 7.63,55.17 7.63,56.54 5.65,58.52 v5.65,62.94 | v10.07,64.31 14.03,68.27 14.03,70.25 10.83,73.45 v10.83,78.48
  Bottom 0.152: 18.45,15.85 18.91,15.85 R14.2 | 18.45,15.85 17.54,15.85 R12.1 | 18.45,15.85 18.45,20.88 15.71,23.62 v13.57,23.62 | v7.33,27.12 9,28.8 9,35.35 10.07,36.42 v10.07,37.33 | v5.65,62.94 5.95,62.94 6.26,63.24 9,63.24 v10.07,64.31 | v10.83,78.48 10.83,79.24 11.9,80.31 12.35,80.31 U1.7
N$25
  Bottom 0.152: R33.2 2.6,10.51 3.97,10.51 4.73,9.75 J5.NORM
N$26  (via drill 0.3)
  Top 0.152: v10.53,81.53 10.53,81.07 10.07,80.62 10.07,73.76 13.73,70.1 13.73,68.42 10.37,65.07 9.92,65.07 7.33,62.48 7.33,57.76 v9.31,55.77
  Bottom 0.152: v10.53,81.53 10.53,83.97 9.15,85.34 7.63,85.34 U1.14 | v9.31,55.77 11.74,53.34 11.74,52.73 11.44,52.42 11.44,51.51 12.2,50.75 13.88,50.75 15.1,51.96 POT4.2
N$27
  Bottom 0.152: R22.1 18.3,55.62 18.3,56.23 18.6,56.54 18.6,56.84 17.69,57.76 17.69,60.8 18.91,62.02 C10.1 18.91,62.18 18.91,63.55 R24.2 18.91,63.7 18.91,64.16 17.84,65.22 17.84,65.68 U4.6 17.69,65.83 17.23,66.29 17.23,72.23 17.99,73 18.76,73 R21.1
N$28
  Bottom 0.152: R40.2 11.44,4.87 12.81,6.24 J6.A
N$29  (via drill 0.3)
  Top 0.152: v3.06,9.45 3.06,14.78 v4.89,16.61
  Bottom 0.152: v3.06,9.45 2.6,8.99 2.6,6.4 J5.A | v4.89,16.61 5.8,17.52 5.95,17.52 7.02,18.59 7.02,19.05 J3.C
N$30
  Bottom 0.152: J3.A 2.6,19.2 2.6,22.7 3.82,23.92 3.82,24.23 3.51,24.53 3.51,25.45 4.28,26.21 5.34,26.21 7.02,27.89 7.02,31.7 J1.C
N$31
  Bottom 0.152: R37.2 1.38,34.29 1.38,32.91 2.45,31.85 J1.A
N$32
  Bottom 0.152: R16.2 14.95,53.79 14.49,53.79 12.81,52.12 POT4.1
N$33  (via drill 0.3)
  Top 0.152: v10.83,80.46 10.83,79.4 12.05,78.18 12.05,72.69 14.34,70.41 14.34,65.53 v10.83,62.02 13.27,59.58 v13.27,56.54 10.22,53.49 10.22,53.03 10.37,52.88 10.37,50.9 12.35,48.92 12.66,48.92 12.96,49.22 v14.79,49.22
  Bottom 0.152: v13.27,56.54 13.27,57.6 C4.2 | v10.83,62.02 12.05,62.02 12.51,62.48 U2.7 | v10.83,80.46 11.9,81.53 12.35,81.53 U1.6 | v14.79,49.22 17.54,51.96 POT4.3
N$34  (via drill 0.3)
  Top 0.152: v10.98,93.72 10.98,92.96 8.7,90.67 8.7,89.91 9.76,88.85 9.76,84.12 | 9.76,82.29 9.76,73.61 12.35,71.01 12.35,69.03 POT2.3 | 9.76,82.29 9.76,84.12 | 9.76,84.12 v9.46,84.12 | v15.1,63.39 15.1,72.23 12.35,74.98 12.35,79.4 11.59,80.16 11.59,81.38 10.68,82.29 9.76,82.29
  Bottom 0.152: 14.34,62.63 13.27,63.7 12.66,63.7 U2.6 | 14.34,62.63 15.1,61.87 15.1,61.57 13.42,59.89 13.42,59.43 C4.1 | v10.98,93.72 10.98,94.94 R10.1 | v9.46,84.12 7.63,84.12 U1.13 | v15.1,63.39 14.34,62.63
N$35
  Bottom 0.152: U5.7 12.66,45.87 13.12,45.87 15.1,43.89 15.1,43.43 L2.K
N$36
  Bottom 0.152: R27.1 11.13,43.13 11.13,46.17 12.05,47.09 12.51,47.09 U5.6 12.66,47.09 13.12,47.09 14.18,46.02 15.1,46.02 L2.A
N$37
  Bottom 0.152: R36.2 10.83,8.07 10.83,9.9 10.68,10.05 U6.6 10.68,10.21 10.68,10.66 13.57,13.56 15.55,13.56 16.77,12.34 17.38,12.34 R34.1
N$38
  Bottom 0.152: R34.2 17.38,10.51 16.01,10.51 15.25,9.75 J6.NORM
N$39
  Bottom 0.152: C8.2 16.47,81.84 16.47,80.46 R18.1 16.47,80.31 16.47,76.81 18.45,74.82 | 18.45,74.82 18.76,74.82 R21.2 18.45,74.82 | 18.45,74.82 15.25,71.62 15.25,71.17 U4.1
N$40  (via drill 0.3)
  Top 0.152: v12.96,29.71 12.96,30.02 6.87,36.12 6.87,39.62 v4.73,41.75 | v3.51,50.59 3.51,59.28 3.06,59.74 3.06,72.69 3.67,73.3 5.65,73.3 9.92,69.03 POT2.2
  Bottom 0.152: v12.96,29.71 14.64,29.71 16.16,28.19 17.08,28.19 R6.1 | v4.73,41.75 3.51,42.97 v3.51,50.59
N$41
  Bottom 0.152: C2.1 3.67,83.51 3.67,85.04 R8.1
N$43  (via drill 0.3)
  Top 0.152: v9,88.69 8.7,88.39 8.7,74.22 11.13,71.78 v11.13,71.32 11.29,71.17 11.29,68.42 7.02,64.16 7.02,57.6 7.93,56.69 7.93,56.23 9.15,55.01 9.92,55.01 12.66,57.76 12.66,59.43 11.13,60.96 v10.83,60.96
  Bottom 0.152: 8.85,60.96 7.33,59.43 6.72,59.43 C3.1 | 8.85,60.96 8.85,61.57 7.93,62.48 7.48,62.48 U2.2 | v11.13,71.32 10.83,71.01 10.07,71.01 R9.1 | 10.83,88.69 v9,88.69 | 10.83,88.69 12.35,90.22 POT1.3 | 10.83,88.69 10.83,85.34 11.9,84.27 12.35,84.27 U1.4 | v10.83,60.96 8.85,60.96
N$44
  Bottom 0.152: R6.2 17.08,26.51 16.01,26.51 15.25,27.28 J2.IN
N$47
  Bottom 0.152: C5.1 0.92,12.34 0.92,14.02 R13.1
N$53
  Bottom 0.152: U1.5 12.51,82.75 12.96,82.75 13.73,81.99 14.64,81.99 C8.1 14.79,81.84 14.79,80.46 R18.2 14.79,80.31 14.79,77.87 16.32,76.35 16.32,74.82 14.64,73.15 14.64,69.8 14.79,69.64 15.71,69.64 16.47,70.41 16.47,71.01 U4.2
N$64
  Bottom 0.152: R2.1 17.08,34.44 15.71,34.44 15.25,34.9 J2.NORM
N$66
  Bottom 0.152: R11.2 2.6,14.17 4.12,14.17 4.73,14.78 J3.IN
N$75  (via drill 0.3)
  Top 0.152: v3.06,24.08 3.06,24.99 4.28,26.21 5.5,26.21 v7.78,28.5 | v9.31,37.94 9.31,53.03 7.33,55.01 7.33,56.38 3.97,59.74 3.97,70.41 v5.8,72.23
  Bottom 0.152: 1.53,15.85 2.45,15.85 R11.1 | 1.53,15.85 1.08,15.85 R13.2 | 1.53,15.85 1.53,22.55 v3.06,24.08 | v7.78,28.5 7.78,30.48 8.7,31.39 8.7,35.51 9.31,36.12 v9.31,37.94 | v5.8,72.23 5.8,72.69 8.09,74.98 8.09,76.65 9,77.57 9,79.4 8.09,80.31 7.63,80.31 U1.10
N$87  (via drill 0.3)
  Top 0.152: v6.41,69.95 6.41,69.49 6.11,69.19 v6.11,66.44
  Bottom 0.152: 6.72,60.96 7.02,61.26 7.33,61.26 U2.1 | 6.72,60.96 5.8,60.04 5.8,58.82 6.56,58.06 6.56,57.76 C3.2 6.72,57.6 7.17,57.15 7.17,52.12 POT3.3 | v6.41,69.95 8.39,71.93 8.39,75.74 9.31,76.65 9.31,80.31 8.09,81.53 7.63,81.53 U1.11 | v6.11,66.44 6.11,65.99 5.65,65.53 5.65,63.85 4.89,63.09 4.89,62.79 6.72,60.96
N$96
  Bottom 0.152: U1.12 7.48,82.75 7.02,82.75 6.26,81.99 5.34,81.99 C7.1 5.34,81.84 5.34,80.46 R17.2 5.19,80.31 2.75,77.87 2.75,76.65 3.06,76.35 3.06,74.52 2.3,73.76 2.3,71.01 U3.2
N$100  (via drill 0.3)
  Top 0.152: v1.38,69.19 v1.38,78.18
  Bottom 0.152: C7.2 3.67,81.84 3.67,80.46 R17.1 3.51,80.31 v1.38,78.18 | R20.2 1.08,72.84 1.08,71.01 U3.1 1.08,70.86 1.38,70.56 v1.38,69.19
OUT1  (via drill 0.3)
  Top 0.152: v5.5,3.96 4.12,3.96 2.3,5.79 2.3,36.88 4.89,39.47 v6.11,39.47
  Bottom 0.152: U3.7 2.14,65.53 2.14,65.07 1.08,64 1.08,63.55 R23.1 1.08,63.39 1.08,62.02 C9.2 1.08,61.87 1.08,60.96 2.3,59.74 2.3,57.76 0.77,56.23 0.77,55.01 1.08,54.71 3.82,54.71 3.97,54.56 3.97,52.88 3.51,52.42 3.51,51.51 4.28,50.75 4.28,46.63 3.82,46.17 3.82,43.13 4.43,42.52 5.34,42.52 6.72,43.89 7.78,43.89 8.09,43.58 8.09,40.69 7.33,39.93 R29.1 7.17,39.77 6.87,39.47 v6.11,39.47 | v5.5,3.96 6.56,2.89 R31.2
OUT2  (via drill 0.3)
  Top 0.152: v13.27,4.72 13.27,5.48 9.76,8.99 9.76,19.96 v11.59,21.79 | v16.16,60.96 16.16,52.73 16.47,52.42 16.47,42.52 v12.66,38.71
  Bottom 0.152: U4.7 16.62,65.68 17.23,65.07 17.23,63.7 R24.1 17.23,63.55 17.23,62.18 C10.2 17.23,62.02 v16.16,60.96 | v13.27,4.72 13.27,2.89 R32.2 | v11.59,21.79 11.59,24.08 12.2,24.69 12.2,26.67 10.68,28.19 10.68,37.03 12.51,38.86 | 12.51,38.86 12.66,39.01 12.66,39.77 R30.1 | 12.51,38.86 v12.66,38.71
TO_LINK  (via drill 0.3)
  Top 0.152: v10.53,11.88 15.55,16.91 16.01,16.91 18.6,19.5 18.6,40.23 JP2.1
  Bottom 0.152: R36.1 9.15,8.07 9.15,9.9 9.31,10.05 U6.7 9.46,10.21 9.46,10.82 v10.53,11.88

### Text on the board
tPlace: Original circuit: / Olivier Gillet / (Mutable Instruments) / / Layout & design: / David Szebenyi / (Antumbra)
bPlace: LEDS | IN | OUT | DVCA | WWW.ANTUMBRA.EU | V1.2